# Altium schematic sheet Sheet1.SchDoc
size A
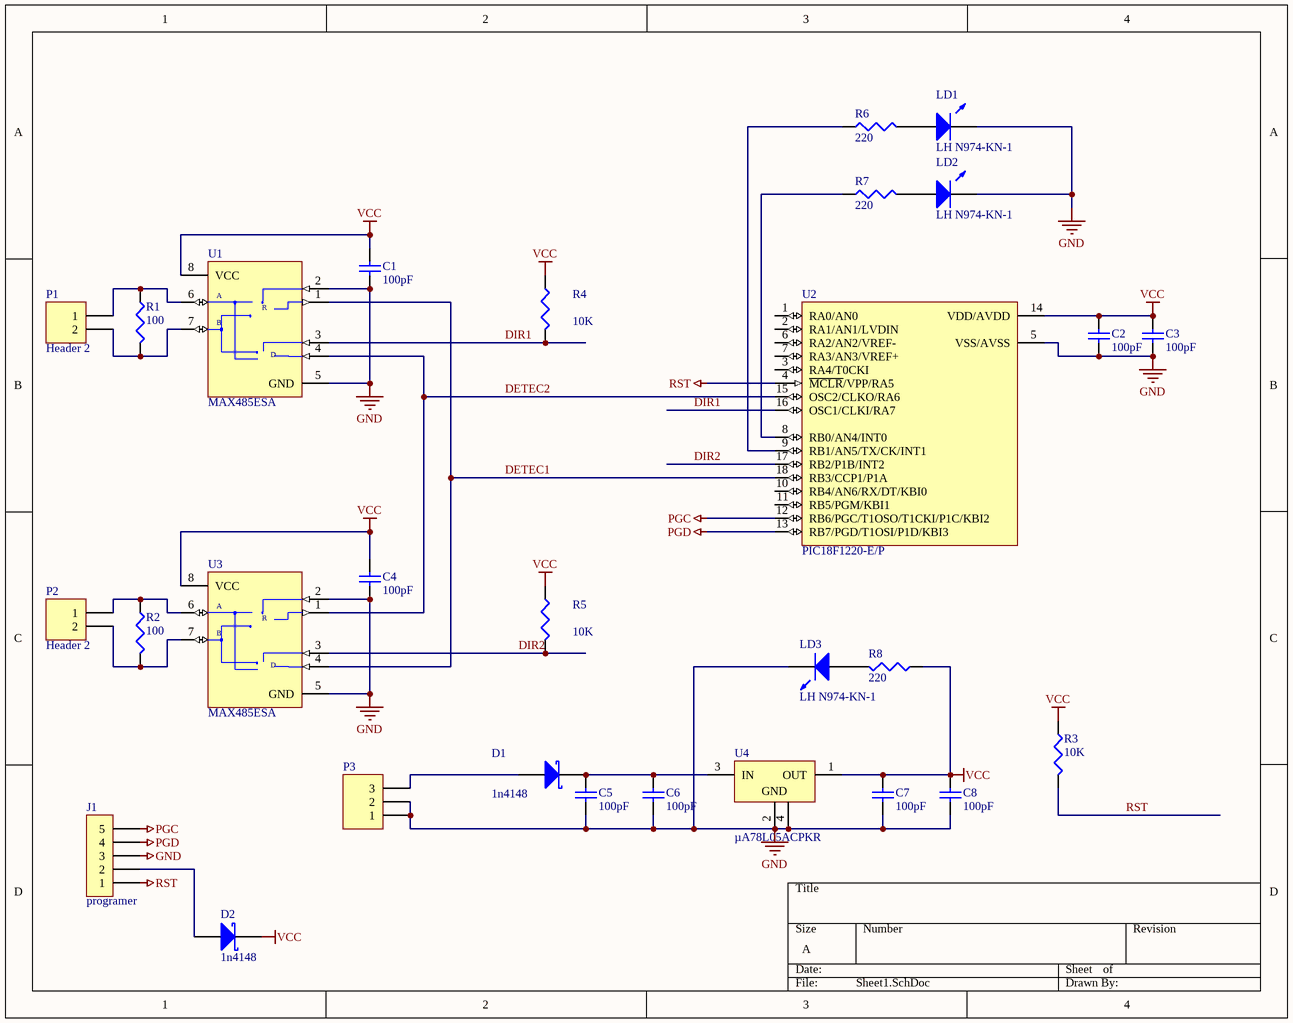
[diagram p0: Sheet1.SchDoc]

## Parts
C1  value 100pF  [RESC2012L]  (hidden comment: Cap Semi)
C2  value 100pF  [RESC2012L]  (hidden comment: Cap Semi)
C3  value 100pF  [RESC2012L]  (hidden comment: Cap Semi)
C4  value 100pF  [RESC2012L]  (hidden comment: Cap Semi)
C5  value 100pF  [RESC2012L]  (hidden comment: Cap Semi)
C6  value 100pF  [RESC2012L]  (hidden comment: Cap Semi)
C7  value 100pF  [RESC2012L]  (hidden comment: Cap Semi)
C8  value 100pF  [RESC2012L]  (hidden comment: Cap Semi)
D1  1n4148  [CD3216-1206]
D2  1n4148  [CD3216-1206]
J1  programer  [CON5]
LD1  LH N974-KN-1  [CD3216-1206]
LD2  LH N974-KN-1  [CD3216-1206]
LD3  LH N974-KN-1  [CD3216-1206]
P1  Header 2  [CON2]
P2  Header 2  [CON2]
P3  (no value)  [CONP3]
R1  value 100  [RESC2012L]  (hidden comment: Res3)
R2  value 100  [RESC2012L]  (hidden comment: Res3)
R3  value 10K  [RESC2012L]  (hidden comment: Res3)
R4  value 10K  [RESC2012L]  (hidden comment: Res3)
R5  value 10K  [RESC2012L]  (hidden comment: Res3)
R6  value 220  [RESC2012L]  (hidden comment: Res3)
R7  value 220  [RESC2012L]  (hidden comment: Res3)
R8  value 220  [RESC2012L]  (hidden comment: Res3)
U1  MAX485ESA  [NSO8_L]
U2  PIC18F1220-E/P  [PDIP300-P18]
U3  MAX485ESA  [NSO8_L]
U4  µA78L05ACPKR  [PK03]

## Nets
GND: C1.1 C2.1 C3.1 C4.1 C5.1 C6.1 C7.1 C8.1 J1.3 LD1.2(K) LD2.2(K) LD3.2(K) P3.1 P3.2 U1.2(~{RE}) U1.5(GND) U2.5(VSS/AVSS) U3.2(~{RE}) U3.5(GND) U4.2(GND) U4.4(GND)
PGC: J1.5 U2.12(RB6/PGC/T1OSO/T1CKI/P1C/KBI2)
PGD: J1.4 U2.13(RB7/PGD/T1OSI/P1D/KBI3)
RST: J1.1 R3.2 U2.4(~{MCLR}/VPP/RA5)
VCC: C1.2 C2.2 C3.2 C4.2 C7.2 C8.2 D2.2(K) R3.1 R4.1 R5.1 R8.1 U1.8(VCC) U2.14(VDD/AVDD) U3.8(VCC) U4.1(OUT)
DETEC1: U1.1(RO) U2.18(RB3/CCP1/P1A) U3.4(DI)
DETEC2: U1.4(DI) U2.15(OSC2/CLKO/RA6) U3.1(RO)
DIR1: R4.2 U1.3(DE) U2.16(OSC1/CLKI/RA7)
DIR2: R5.2 U2.17(RB2/P1B/INT2) U3.3(DE)
NetC5_2: C5.2 C6.2 D1.2(K) U4.3(IN)
NetD1_1: D1.1(A) P3.3
NetD2_1: D2.1(A) J1.2
NetLD1_1: LD1.1(A) R6.2
NetLD2_1: LD2.1(A) R7.2
NetLD3_1: LD3.1(A) R8.2
NetP1_1: P1.1 R1.1 U1.6(A)
NetP1_2: P1.2 R1.2 U1.7(B)
NetP2_1: P2.1 R2.1 U3.6(A)
NetP2_2: P2.2 R2.2 U3.7(B)
NetR6_1: R6.1 U2.9(RB1/AN5/TX/CK/INT1)
NetR7_1: R7.1 U2.8(RB0/AN4/INT0)

Not connected (* = marked no-connect by the designer): U2 1(RA0/AN0) 2(RA1/AN1/LVDIN) 3(RA4/T0CKI) 6(RA2/AN2/VREF-) 7(RA3/AN3/VREF+) 10(RB4/AN6/RX/DT/KBI0) 11(RB5/PGM/KBI1)

## Notes on the sheet
- (in symbol MAX485ESA) R; D

## Library data of the parts
C1-C8 = Cap Semi: Capacitor (Semiconductor SIM Model); Published: 8-Jun-2000; LatestRevisionDate: 29-May-2009; LatestRevisionNote: IPC-7351 Footprint Added.; PackageReference: C1206; Publisher: Altium Limited; PackageDescription: Chip Capacitor
D1 D2 = 1N4148_SMD: Schottky Diode; Published: 8-Jun-2000; LatestRevisionDate: 17-Jul-2002; LatestRevisionNote: Re-released for DXP Platform.; PackageReference: SMB; Publisher: Altium Limited; PackageDescription: DO-214-AA/SMB; 2 C-Bend Leads; Body 5.3 x 3.6 mm, inc. leads (LxW); Code_JEDEC: DO-214-AA
J1 = CON5: Connector
LD1-LD3 = LEDRED1206: LED CHIPLED 645NM RED DIFF 1206; VENDOR: OSRAM Opto Semiconductors Inc; Indicate: 12V; VENDOR P/N: LH N974-KN-1; GGC VENDOR: OSRAM Opto Semiconductors Inc; GCC P/N: LH N974-KN-1; DIGIKEY P/N: P0.0JCT-ND; DIGIKEY MOQ1: 0.11
P1 P2 = Header 2: Header, 2-Pin; LatestRevisionDate: 17-Jul-2002; LatestRevisionNote: Re-released for DXP Platform.; Publisher: Altium Limited
P3 = Header 3: Header, 3-Pin; LatestRevisionDate: 17-Jul-2002; LatestRevisionNote: Re-released for DXP Platform.; Publisher: Altium Limited
R1-R8 = Res3: Resistor; Published: 8-Jun-2000; LatestRevisionDate: 29-May-2009; LatestRevisionNote: IPC-7351 Footprint Added.; PackageReference: J1-0603; Publisher: Altium Limited; PackageDescription: Chip Resistor
U1 U3 = MAX485ESA: Low-Power, Slew-Rate-Limited RS-485/RS-422 Transceiver; Published: 16-Jan-2001; LatestRevisionDate: 13-Apr-2006; LatestRevisionNote: IPC-7351 Footprint Added.; DatasheetVersion: Feb-1996; PackageReference: NSO8; Publisher: Altium Limited; PackageDescription: 8-Pin Small Outline Integrated Circuit 1.27 mm Pitch; Code_JEDEC: MS-012-AA; Code_IPC: SOIC127P600-8; ComponentLink1Description: Manufacturer Link; ComponentLink1URL: http://www.maxim-ic.com/; ComponentLink2Description: Datasheet; ComponentLink2URL: http://pdfserv.maxim-ic.com/en/ds/MAX1487-MAX491.pdf
U2 = PIC18F1220-E/P: High Performance, Enhanced Flash Microcontroller with 10-Bit A/D and nanoWatt Technology, 4K Flash, 18-Pin PDIP, Extended Temperature; Published: 11-Oct-2004; LatestRevisionDate: 29-Jan-2009; LatestRevisionNote: Sch. layout revised. 3D Model Removed.; DatasheetVersion: revF, Feb-2007; PackageVersion: revBB, Aug-2009; PackageReference: PDIP300-P18; Publisher: Altium Limited; PackageDescription: 18-Lead Plastic Dual In-Line (P) - 300 mil Body [PDIP]; Supplier 1: Digi-Key; Supplier Part Number 1: PIC18F1220-E/P-ND; Supplier 2: Farnell; Supplier Part Number 2: 1579595; Code_JEDEC: MS-001; ComponentLink1Description: Datasheet; ComponentLink1URL: http://ww1.microchip.com/downloads/en/DeviceDoc/39605F.pdf; ComponentLink2Description: Packaging Specification; ComponentLink2URL: http://www.microchip.com/stellent/groups/techpub_sg/documents/packagingspec/en012702.pdf; ComponentLink3Description: Microchip.com Home; ComponentLink3URL: http://www.microchip.com/
U4 = µA78L05ACPKR: Positive-Voltage Regulator; Note: Pin 2 is electrically connected to TAB.; Published: 15-Apr-2002; DatasheetVersion: Jul-2000; PackageVersion: Oct-1994; PackageReference: PK03; Publisher: Altium Limited; PackageDescription: SOT-89; Body 4.6 x 4.25 mm, inc. leads (LxW max); Code_JEDEC: TO-243-AA; Code_IPC: SOT 89; ComponentLink1Description: Manufacturer Link; ComponentLink1URL: http://www.ti.com/; ComponentLink2Description: Datasheet; ComponentLink2URL: http://www-s.ti.com/sc/ds/ua78l05a.pdf